# Altium project VrBikeV1.PrjPcb
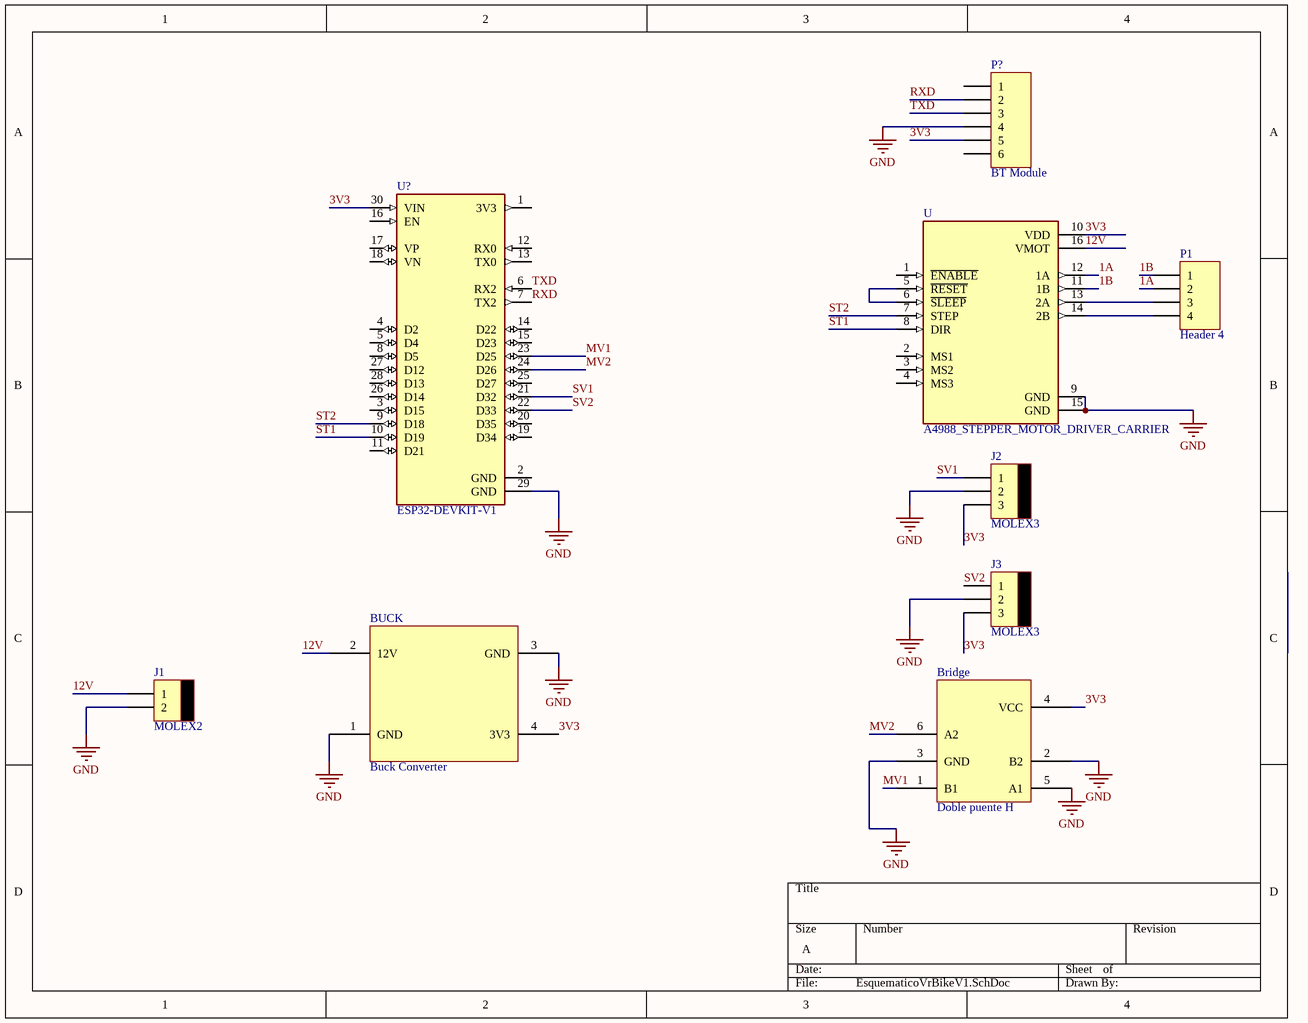
[diagram p0: EsquematicoVrBikeV1.SchDoc]
1 sheet, 9 parts. Net scope: global (net labels, ports and power ports of the same name join across sheets).
Board file: PCBVrBikeV1.PcbDoc

## Sheet EsquematicoVrBikeV1.SchDoc
size A

### Parts
Bluetooth  BT Module  [HDR1X6]
Bridge  Doble puente H  [Vibration Driver]
BUCK  Buck Converter  [Buck Converter Modulo]
ESP32  ESP32-DEVKIT-V1  [MODULE_ESP32_DEVKIT_V1]
J1  MOLEX2  [MOLEX2]
J2  MOLEX3  [MOLEX3]
J3  MOLEX3  [MOLEX3]
P1  Header 4  [HDR1X4]
U  A4988_STEPPER_MOTOR_DRIVER_CARRIER  [MODULE_A4988_STEPPER_MOTOR_DRIVER_CARRIER]

### Nets
GND: Bluetooth.4 Bridge.2(B2) Bridge.3(GND) Bridge.5(A1) BUCK.1(GND) BUCK.3(GND) ESP32.29(GND) J1.2 J2.2 J3.2 U.9(GND) U.15(GND)
1A: P1.2 U.12(1A)
1B: P1.1 U.11(1B)
3V3: Bluetooth.5 Bridge.4(VCC) BUCK.4(3V3) ESP32.30(VIN) J2.3 J3.3 U.10(VDD)
12V: BUCK.2(12V) J1.1 U.16(VMOT)
MV1: Bridge.1(B1) ESP32.23(D25)
MV2: Bridge.6(A2) ESP32.24(D26)
RXD: Bluetooth.2 ESP32.7(TX2)
ST1: ESP32.10(D19) U.8(DIR)
ST2: ESP32.9(D18) U.7(STEP)
SV1: ESP32.21(D32) J2.1
SV2: ESP32.22(D33) J3.1
TXD: Bluetooth.3 ESP32.6(RX2)
NetP1_3: P1.3 U.13(2A)
NetP1_4: P1.4 U.14(2B)
NetU_5: U.5(~{RESET}) U.6(~{SLEEP})

Not connected (* = marked no-connect by the designer): Bluetooth 1 6; ESP32 1(3V3) 2(GND) 3(D15) 4(D2) 5(D4) 8(D5) 11(D21) 12(RX0) 13(TX0) 14(D22) 15(D23) 16(EN) 17(VP) 18(VN) 19(D34) 20(D35) 25(D27) 26(D14) 27(D12) 28(D13); U 1(~{ENABLE}) 2(MS1) 3(MS2) 4(MS3)

### Library data of the parts
Bluetooth = Header 6: Header, 6-Pin
Bridge = Component_1: Modulo Doble puente H motores vibración
BUCK = Component_1: Buck Converter module
ESP32 = ESP32-DEVKIT-V1: Dual core, Wi-Fi: 2.4 GHz up to 150 Mbits/s,BLE (Bluetooth Low Energy) and legacy Bluetooth, 32 bits, Up to 240 MHz; MF: Do it
P1 = Header 4: Header, 4-Pin; LatestRevisionDate: 17-Jul-2002; LatestRevisionNote: Re-released for DXP Platform.; Publisher: Altium Limited
U = A4988_STEPPER_MOTOR_DRIVER_CARRIER: Stepper Motor Driver; MP: A4988 STEPPER MOTOR DRIVER CARRIER; MF: Pololu; Availability: Unavailable; Price: None; Package: None; Value: *; SnapEDA_Link: https://www.snapeda.com/parts/A4988%20STEPPER%20MOTOR%20DRIVER%20CARRIER/Pololu/view-part/1499394/?ref=snap